# Altium schematic sheet Circuit Schematics.SchDoc
size A3; SheetNumber: 3; SheetTotal: 3
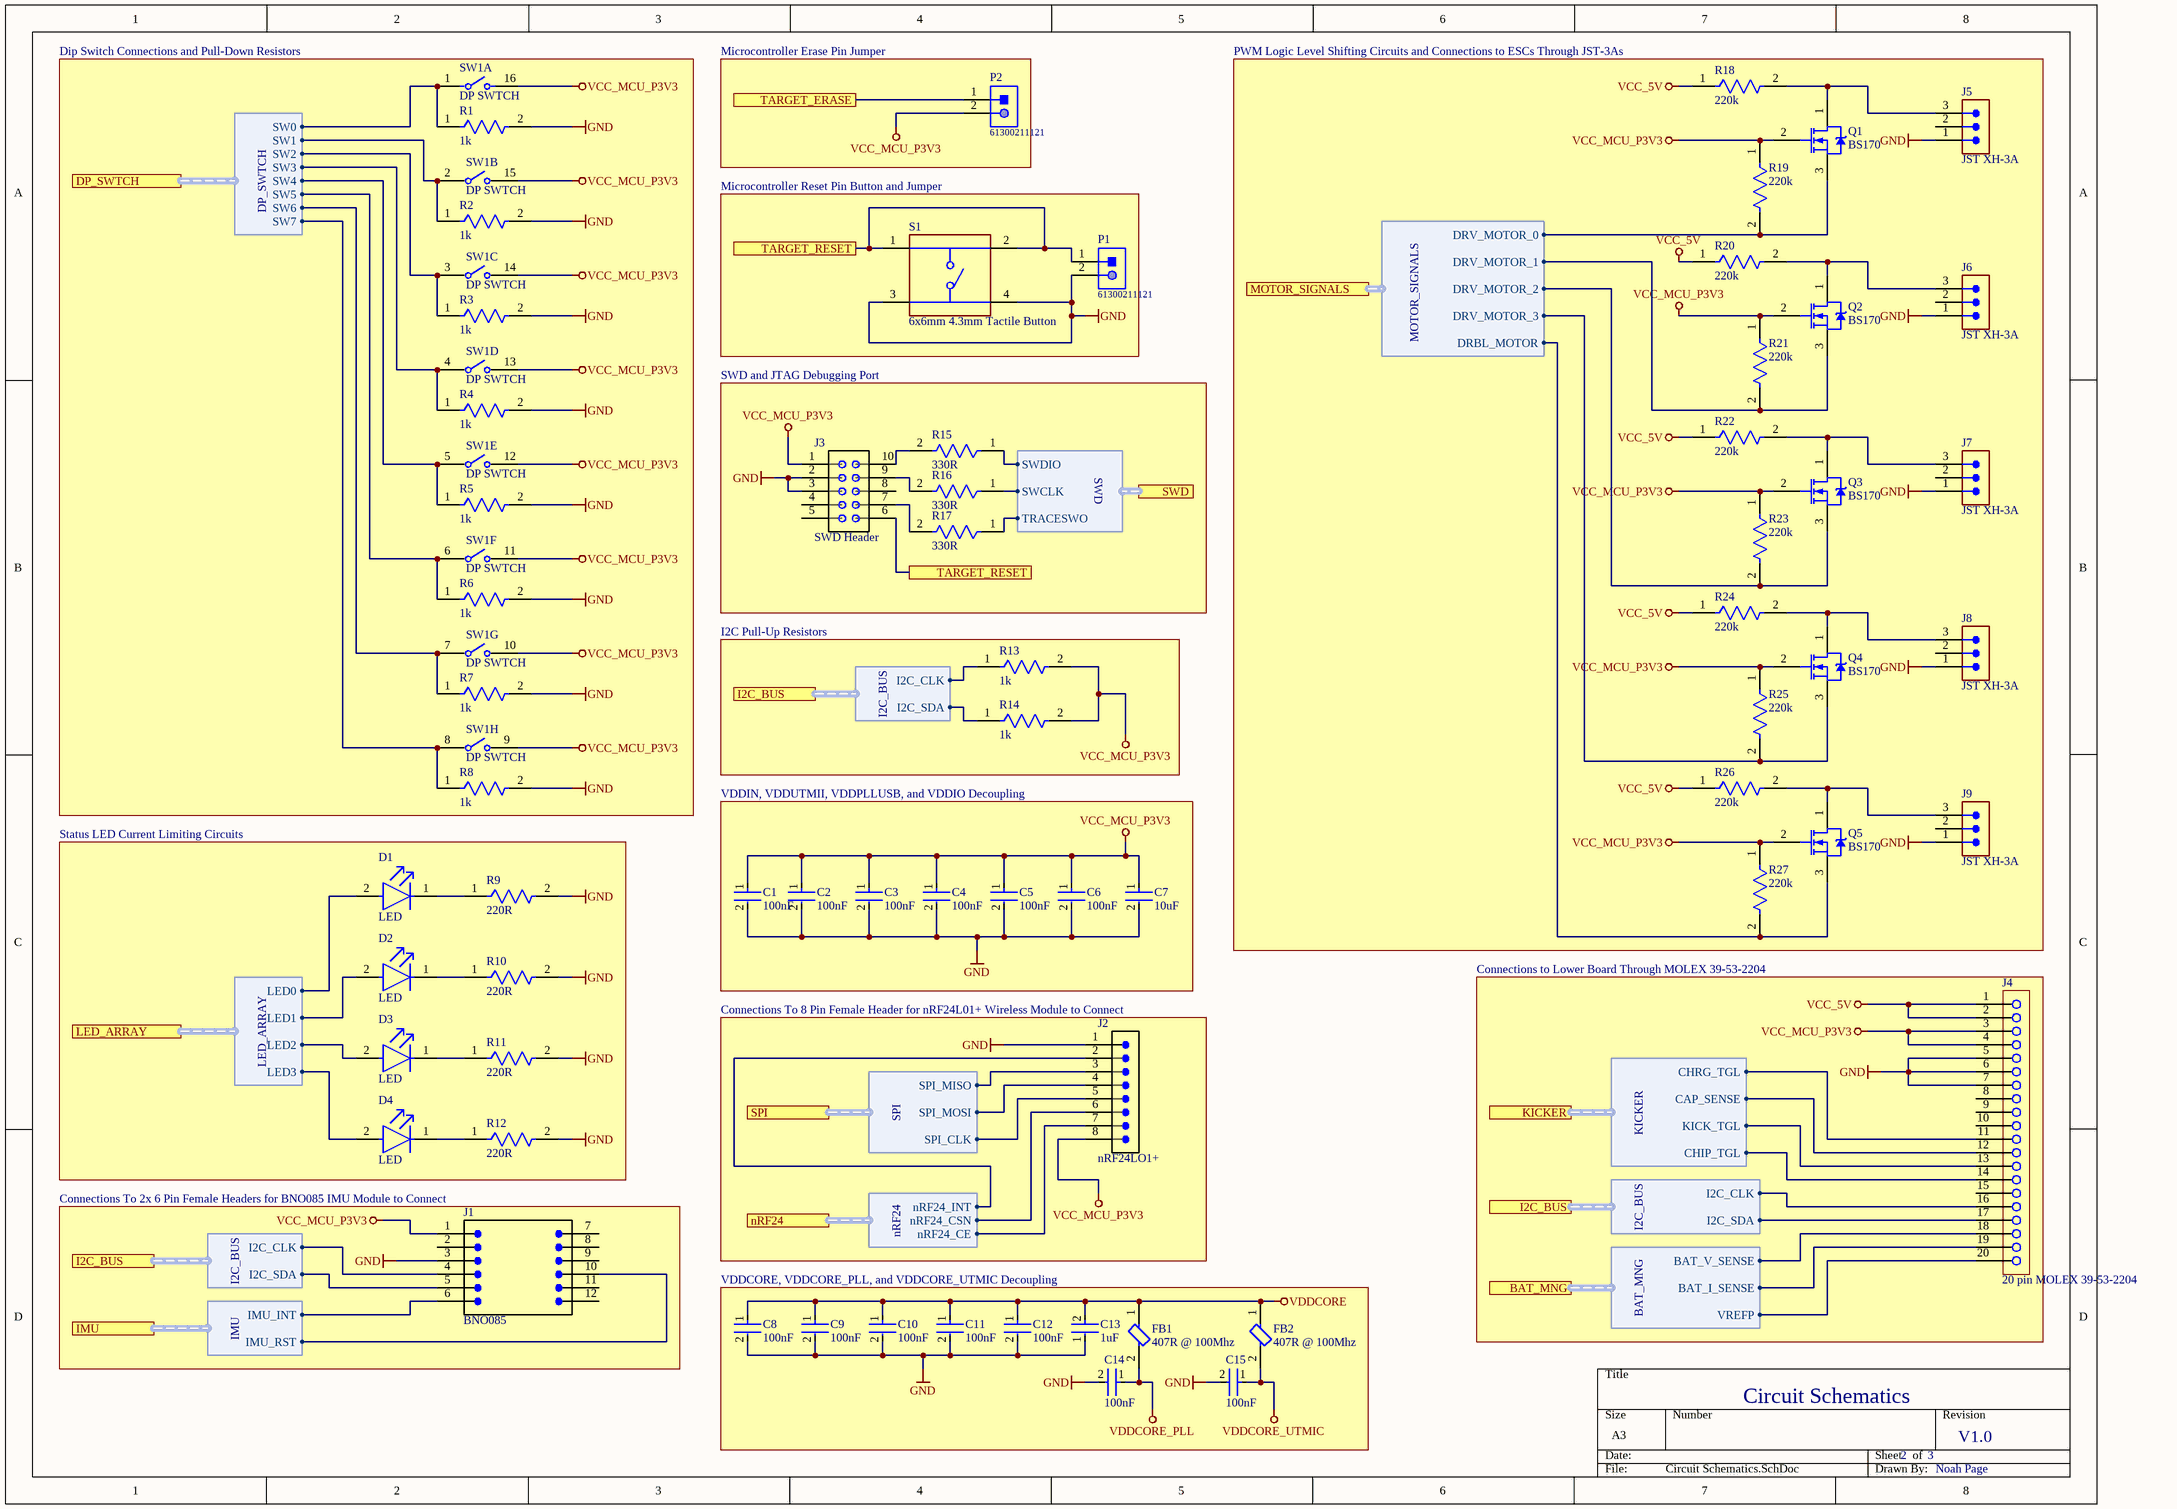
[diagram p0: Circuit Schematics.SchDoc]

## Parts
C1  100nF  [Capacitor 100nF 50V 20% 0603]
C2  100nF  [Capacitor 100nF 50V 20% 0603]
C3  100nF  [Capacitor 100nF 50V 20% 0603]
C4  100nF  [Capacitor 100nF 50V 20% 0603]
C5  100nF  [Capacitor 100nF 50V 20% 0603]
C6  100nF  [Capacitor 100nF 50V 20% 0603]
C7  10uF  [Capacitor 10uF 50V 20% 0805]
C8  100nF  [Capacitor 100nF 50V 20% 0603]
C9  100nF  [Capacitor 100nF 50V 20% 0603]
C10  100nF  [Capacitor 100nF 50V 20% 0603]
C11  100nF  [Capacitor 100nF 50V 20% 0603]
C12  100nF  [Capacitor 100nF 50V 20% 0603]
C13  1uF  [Capacitor 1uF 50V 10% 0603]
C14  100nF  [Capacitor 100nF 50V 20% 0603]
C15  100nF  [Capacitor 100nF 50V 20% 0603]
D1  LED  [LED RED 1206]
D2  LED  [LED RED 1206]
D3  LED  [LED RED 1206]
D4  LED  [LED RED 1206]
FB1  407R @ 100Mhz  [FERRITE BEAD 470R 100Mhz]
FB2  407R @ 100Mhz  [FERRITE BEAD 470R 100Mhz]
J1  BNO085  [(BNO085) FEMALE 2ct 8 unit separation 1x6 THT]
J2  nRF24LO1+  [(nRF24) FEMALE 1x8 2.54]
J3  SWD Header  [(SWD) FEMALE 10 pin 2 row 1.27mm]
J4  20 pin MOLEX 39-53-2204  [20Pin Molex 39-53-2204]
J5  JST XH-3A  [FP-B3B-XH-AM_LF_SN-MFG]
J6  JST XH-3A  [FP-B3B-XH-AM_LF_SN-MFG]
J7  JST XH-3A  [FP-B3B-XH-AM_LF_SN-MFG]
J8  JST XH-3A  [FP-B3B-XH-AM_LF_SN-MFG]
J9  JST XH-3A  [FP-B3B-XH-AM_LF_SN-MFG]
P1  61300211121  [2x 2.54mm MALE header pin]
P2  61300211121  [2x 2.54mm MALE header pin]
Q1  BS170  [MOSFET BS170]
Q2  BS170  [MOSFET BS170]
Q3  BS170  [MOSFET BS170]
Q4  BS170  [MOSFET BS170]
Q5  BS170  [MOSFET BS170]
R1  1k  [RESISTOR 1k 1% 1/4W 0603]
R2  1k  [RESISTOR 1k 1% 1/4W 0603]
R3  1k  [RESISTOR 1k 1% 1/4W 0603]
R4  1k  [RESISTOR 1k 1% 1/4W 0603]
R5  1k  [RESISTOR 1k 1% 1/4W 0603]
R6  1k  [RESISTOR 1k 1% 1/4W 0603]
R7  1k  [RESISTOR 1k 1% 1/4W 0603]
R8  1k  [RESISTOR 1k 1% 1/4W 0603]
R9  220R  [RESISTOR 220R 5% 1/4W 0603]
R10  220R  [RESISTOR 220R 5% 1/4W 0603]
R11  220R  [RESISTOR 220R 5% 1/4W 0603]
R12  220R  [RESISTOR 220R 5% 1/4W 0603]
R13  1k  [RESISTOR 1k 1% 1/4W 0603]
R14  1k  [RESISTOR 1k 1% 1/4W 0603]
R15  330R  [RESISTOR 330R 5% 1/4W 0603]
R16  330R  [RESISTOR 330R 5% 1/4W 0603]
R17  330R  [RESISTOR 330R 5% 1/4W 0603]
R18  220k  [RESISTOR 220k 5% 1/4W 0603]
R19  220k  [RESISTOR 220k 5% 1/4W 0603]
R20  220k  [RESISTOR 220k 5% 1/4W 0603]
R21  220k  [RESISTOR 220k 5% 1/4W 0603]
R22  220k  [RESISTOR 220k 5% 1/4W 0603]
R23  220k  [RESISTOR 220k 5% 1/4W 0603]
R24  220k  [RESISTOR 220k 5% 1/4W 0603]
R25  220k  [RESISTOR 220k 5% 1/4W 0603]
R26  220k  [RESISTOR 220k 5% 1/4W 0603]
R27  220k  [RESISTOR 220k 5% 1/4W 0603]
S1  6x6mm 4.3mm Tactile Button  [BUTTON 6x6x4.3 TACTILE SWITCH]
SW1  DP SWTCH  [8P DP SWTCH]  (parts A,B,C,D,E,F,G,H of 8)

## Blocks framed on the sheet
Dip Switch Connections and Pull-Down Resistors: R1-R8 SW1
Microcontroller Erase Pin Jumper: P2
Microcontroller Reset Pin Button and Jumper: P1 S1
SWD and JTAG Debugging Port: J3 R15-R17
I2C Pull-Up Resistors: R13 R14
VDDIN, VDDUTMII, VDDPLLUSB, and VDDIO Decoupling: C1-C7
Status LED Current Limiting Circuits: D1-D4 R9-R12
Connections to Lower Board Through MOLEX 39-53-2204: J4
VDDCORE, VDDCORE_PLL, and VDDCORE_UTMIC Decoupling: C8-C15 FB1 FB2

## Ports
BAT_MNG (harness BAT_MNG, see Microcontroller Schematic[3D]), DP_SWTCH (harness DP_SWTCH, see Microcontroller Schematic[1A]), I2C_BUS (harness I2C_BUS, see Circuit Schematics[1D], Circuit Schematics[3B], Microcontroller Schematic[1B]), I2C_BUS (harness I2C_BUS, see Circuit Schematics[1D], Circuit Schematics[6D], Microcontroller Schematic[1B]), I2C_BUS (harness I2C_BUS, see Circuit Schematics[3B], Circuit Schematics[6D], Microcontroller Schematic[1B]), IMU (harness IMU, see Microcontroller Schematic[1B]), KICKER (harness KICKER, see Microcontroller Schematic[3D]), LED_ARRAY (harness LED_ARRAY, see Microcontroller Schematic[1B]), MOTOR_SIGNALS (harness MOTOR_SIGNALS, see Microcontroller Schematic[4D]), nRF24 (harness nRF24, see Microcontroller Schematic[1C]), SPI (harness SPI, see Microcontroller Schematic[1C]), SWD (harness SWD, see Microcontroller Schematic[2D]), TARGET_ERASE (see Microcontroller Schematic[1C]), TARGET_RESET (see Circuit Schematics[3A], Microcontroller Schematic[1C]), TARGET_RESET (see Circuit Schematics[4B], Microcontroller Schematic[1C])

## Harnesses
DP_SWTCH: SW0, SW1, SW2, SW3, SW4, SW5, SW6, SW7
LED_ARRAY: LED0, LED1, LED2, LED3
I2C_BUS: I2C_CLK, I2C_SDA
IMU: IMU_INT, IMU_RST
SPI: SPI_MISO, SPI_MOSI, SPI_CLK
nRF24: nRF24_CSN, nRF24_CE, nRF24_INT
SWD: SWDIO, SWCLK, TRACESWO
BAT_MNG: BAT_V_SENSE, BAT_I_SENSE, VREFP
KICKER: CHRG_TGL, CAP_SENSE, KICK_TGL, CHIP_TGL
MOTOR_SIGNALS: DRV_MOTOR_0, DRV_MOTOR_1, DRV_MOTOR_2, DRV_MOTOR_3, DRBL_MOTOR

## Nets
GND: C1.2 C2.2 C3.2 C4.2 C5.2 C6.2 C7.2 C8.2 C9.2 C10.2 C11.2 C12.2 C13.1 C14.2 C15.2 J1.3 J2.1 J3.2 J3.3 J4.5 J4.6 J4.7 J5.1 J6.1 J7.1 J8.1 J9.1 P1.2 R1.2 R2.2 R3.2 R4.2 R5.2 R6.2 R7.2 R8.2 R9.2 R10.2 R11.2 R12.2 S1.3 S1.4
VCC_5V: J4.1 J4.2 R18.1 R20.1 R22.1 R24.1 R26.1
VCC_MCU_P3V3: C1.1 C2.1 C3.1 C4.1 C5.1 C6.1 C7.1 J1.1 J2.8 J3.1 J4.3 J4.4 P2.2 Q1.2(G) Q2.2(G) Q3.2(G) Q4.2(G) Q5.2(G) R13.2 R14.2 R19.1 R21.1 R23.1 R25.1 R27.1 SW1.9 SW1.10 SW1.11 SW1.12 SW1.13 SW1.14 SW1.15 SW1.16
VDDCORE: C8.1 C9.1 C10.1 C11.1 C12.1 C13.2 FB1.1 FB2.1
VDDCORE_PLL: C14.1 FB1.2
VDDCORE_UTMIC: C15.1 FB2.2
TARGET_ERASE: P2.1 ; port TARGET_ERASE
TARGET_RESET: J3.6 P1.1 S1.1 S1.2 ; port TARGET_RESET
NetD1_1: D1.1(C) R9.1
NetD1_2: D1.2(A) ; port LED_ARRAY.LED0
NetD2_1: D2.1(C) R10.1
NetD2_2: D2.2(A) ; port LED_ARRAY.LED1
NetD3_1: D3.1(C) R11.1
NetD3_2: D3.2(A) ; port LED_ARRAY.LED2
NetD4_1: D4.1(C) R12.1
NetD4_2: D4.2(A) ; port LED_ARRAY.LED3
NetJ1_4: J1.4 J4.16 R13.1 ; port I2C_BUS.I2C_CLK
NetJ1_5: J1.5 J4.17 R14.1 ; port I2C_BUS.I2C_SDA
NetJ1_6: J1.6 ; port IMU.IMU_INT
NetJ1_10: J1.10 ; port IMU.IMU_RST
NetJ2_2: J2.2 ; port nRF24.nRF24_INT
NetJ2_3: J2.3 ; port SPI.SPI_MISO
NetJ2_4: J2.4 ; port SPI.SPI_MOSI
NetJ2_5: J2.5 ; port SPI.SPI_CLK
NetJ2_6: J2.6 ; port nRF24.nRF24_CSN
NetJ2_7: J2.7 ; port nRF24.nRF24_CE
NetJ3_7: J3.7 R17.2
NetJ3_9: J3.9 R16.2
NetJ3_10: J3.10 R15.2
NetJ4_11: J4.11 ; port KICKER.CHRG_TGL
NetJ4_12: J4.12 ; port KICKER.CAP_SENSE
NetJ4_13: J4.13 ; port KICKER.KICK_TGL
NetJ4_14: J4.14 ; port KICKER.CHIP_TGL
NetJ4_18: J4.18 ; port BAT_MNG.BAT_V_SENSE
NetJ4_19: J4.19 ; port BAT_MNG.BAT_I_SENSE
NetJ4_20: J4.20 ; port BAT_MNG.VREFP
NetJ5_3: J5.3 Q1.1(D) R18.2
NetJ6_3: J6.3 Q2.1(D) R20.2
NetJ7_3: J7.3 Q3.1(D) R22.2
NetJ8_3: J8.3 Q4.1(D) R24.2
NetJ9_3: J9.3 Q5.1(D) R26.2
NetQ1_3: Q1.3(S) R19.2 ; port MOTOR_SIGNALS.DRV_MOTOR_0
NetQ2_3: Q2.3(S) R21.2 ; port MOTOR_SIGNALS.DRV_MOTOR_1
NetQ3_3: Q3.3(S) R23.2 ; port MOTOR_SIGNALS.DRV_MOTOR_2
NetQ4_3: Q4.3(S) R25.2 ; port MOTOR_SIGNALS.DRV_MOTOR_3
NetQ5_3: Q5.3(S) R27.2 ; port MOTOR_SIGNALS.DRBL_MOTOR
NetR1_1: R1.1 SW1.1 ; port DP_SWTCH.SW0
NetR2_1: R2.1 SW1.2 ; port DP_SWTCH.SW1
NetR3_1: R3.1 SW1.3 ; port DP_SWTCH.SW2
NetR4_1: R4.1 SW1.4 ; port DP_SWTCH.SW3
NetR5_1: R5.1 SW1.5 ; port DP_SWTCH.SW4
NetR6_1: R6.1 SW1.6 ; port DP_SWTCH.SW5
NetR7_1: R7.1 SW1.7 ; port DP_SWTCH.SW6
NetR8_1: R8.1 SW1.8 ; port DP_SWTCH.SW7
NetR15_1: R15.1 ; port SWD.SWDIO
NetR16_1: R16.1 ; port SWD.SWCLK
NetR17_1: R17.1 ; port SWD.TRACESWO

Not connected (* = marked no-connect by the designer): J1 2 7 8 9 11 12; J3 4 5 8; J4 8 9 10 15; J5 2; J6 2; J7 2; J8 2; J9 2

## Notes on the sheet
- (near R18) PWM Logic Level Shifting Circuits and Connections to ESCs Through JST-3As
- (near J2) Connections To 8 Pin Female Header for nRF24L01+ Wireless Module to Connect
- (near J1) Connections To 2x 6 Pin Female Headers for BNO085 IMU Module to Connect
- Circuit Schematics
- 2
- 3
- V1.0
- Noah Page

## Library data of the parts
C1-C6 C8-C12 C14 C15 = Capacitor 100nF 50V 20% 0603: Cap Ceramic 100nF 50V X7R ±20% Pad SMD 0603 +125°C T/R; Mount: Surface Mount; Lead Free: Lead Free; Max Operating Temperature: 125°C; Voltage Rating: 50V; Case Code (Imperial): 0603; Capacitance: 100nF; Height: 0.8mm; Length: 1.6mm; Tolerance: 20%; Case Code (Metric): 1608; Thickness: 0.035inch; Depth: 0.8mm; Width: 0.031inch; Package Quantity: 1; Min Operating Temperature: -55°C; Case/Package: 0603; Radiation Hardening: No; Voltage Rating (DC): 50V; Dielectric: X7R; Packaging: Tape and Reel; Digi-Key_Part_Number_1: 1276-1941-1-ND
C7 = Capacitor 10uF 50V 20% 0805: Chip Multilayer Ceramic Capacitors for General Purpose, 0805, 10uF, X5R, 15%, 20%, 50V; Digi-Key_Part_Number_1: 490-18664-1-ND
C13 = Capacitor 1uF 50V 10% 0603: Multilayer Ceramic Capacitors 1μF ±10% 50V X5R SMD 0603; Lead Free: Lead Free; Height: 0.8mm; Mount: Surface Mount; Radiation Hardening: No; Thickness: 0.035inch; Length: 1.6mm; Max Operating Temperature: 85°C; REACH SVHC: No SVHC; Min Operating Temperature: -55°C; Construction: Flat; RoHS Compliant: Yes; Voltage Rating: 50V; Dielectric: X5R; Packaging: Tape and Reel; Termination: SMD/SMT; Voltage Rating (DC): 50V; Case Code (Imperial): 0603; Voltage: 50V; Width: 0.031inch; Weight: 7.1E-05oz; Capacitance: 1uF; Depth: 0.8mm; Case Code (Metric): 1608; Series: C; Case/Package: 0603; Tolerance: 10%; Resistor Type: Ceramic; Number of Pins: 2; Dielectric Material: Ceramic; Package Quantity: 1; Digi-Key_Part_Number_1: 445-7468-1-ND
D1-D4 = LED RED 1206: LED RED DIFFUSED 1206 SMD; Manufacturer: VCC; Manufacturer Part Number: CMD15-21VRD/TR8; Led Orientation: Top View; Peak Emmision Wavelength: 640nm; Forward Current: 20mA; Power Dissipation: 105mW; Luminous Intensity: 4mcd; Forward Voltage: 2V; Reverse Voltage: 5V; Lead Free: Yes; Device Class L1: Optoelectronics; Package: CMD15-21; Temperature Range High: +85°C; Digikey Description: LED RED DIFFUSED 1206 SMD; Mouser Description: Standard LEDs - SMD RED DIFFUSED; Height: 1.3mm; ComponentLink2Description: Datasheet; ComponentLink2URL: https://www.vcclite.com/wp-content/uploads/wpallimport/files/files/CMD1521SeriesRev1.pdf; Temperature: -40°C to +85°C; Automotive: No; Octopart: https://octopart.com/cmd15-21vrd%2Ftr8-vcc-26668835; Temperature Range Low: -40°C; Device Class L3: unset; Colour: Red; Category: Diode; Device Class L2: LEDs; RoHS: TRUE; Digi-Key_Part_Number_1: L62301CT-ND
FB1 FB2 = Ferrite Bead 470R @ 100Mhz 25%: Chip Ferrite Bead, 0603, 470Ω @ 100MHz, 0.35Ω, 25%, 550mA; Resistance: 350mR; Number of Circuits: 1; Max DC Current: 500mA; Shielding: Unshielded; Impedance: 470R; Weight: 7.1E-05oz; Ratings: AEC-Q200; Contact Plating: Tin; Package Quantity: 4000; Case/Package: 0603; Number of Pins: 2; Core Material: Ferrite; Height: 0.037inch; Lead Free: Lead Free; Max Operating Temperature: 125°C; Width: 0.031inch; Termination: Flat; Case Code (Metric): 1608; Case Code (Imperial): 0603; Tolerance: 25%; Depth: 0.8mm; Min Operating Temperature: -55°C; Max Current Rating: 550mA; Packaging: Tape and Reel; Mount: Surface Mount; Length: 1.6mm; Radiation Hardening: No; Number of Lines: 1; Test Frequency: 100MHz; REACH SVHC: No SVHC; DC Resistance (DCR): 350mR; Digi-Key_Part_Number_1: 490-11025-1-ND
J1 = (BNO085) FEMALE 2ct 8 unit separation 1x6 THT: No Description Available; Mfr_Name: Sullins; Manufacturer_Part_Number: PPTC061LFBN-RC; Copyright: Copyright (C) 2022 Ultra Librarian. All rights reserved.; Digi-Key_Part_Number_1: S7004-ND; RefDes: RefDes; Type: DEV
J2 = (nRF24) FEMALE 1x8 2.54: No Description Available; Mfr_Name: Sullins; Manufacturer_Part_Number: PPTC081LFBN-RC; Copyright: Copyright (C) 2022 Ultra Librarian. All rights reserved.; Digi-Key_Part_Number_1: S7006-ND; RefDes: RefDes; Type: DEV
J3 = (SWD) FEMALE 10 pin 2 row 1.27mm: No Description Available; Mfr_Name: CNC Tech; Manufacturer_Part_Number: 3220-10-0100-00; Copyright: Copyright (C) 2022 Ultra Librarian. All rights reserved.; Digi-Key_Part_Number_1: 1175-1627-ND; RefDes: RefDes; Type: DEV
J4 = 20 pin MOLEX 39-53-2204: 1.25 mm Pitch FPC Connector, 5.0 mm Mated Height, Right Angle, ZIF, Through Hole, Top Contact, 20 Circuits, -20 to 80 degC, ELV and RoHS Compliant, Tray; PCB Locator: No; Voltage (Max): 200V; Pitch - Mating Interface: 1.25mm; Entry Angle: 90degrees Angle; PCB Retention: None; Circuits (Loaded): 20; Material - Plating Termination: Tin-Bismuth; Material - Metal: Phosphor Bronze; Current (Max per Contact): 1A; Mated Height: 5.00mm; Durability (mating cycles max): 30; ComponentLink1Description: Manufacturer URL; ComponentLink2Description: Datasheet; ComponentLink1URL: http://www.molex.com/molex/index.jsp; ComponentLink3Description: Package Specification; Polarized to PCB: No; Packing: Tray; Contact Position: Top; ComponentLink2URL: http://www.molex.com/webdocs/datasheets/pdf/en-us/0039532204_FFC_FPC_CONNECTORS.pdf; Number of Rows: 1; ComponentLink3URL: http://www.molex.com/pdm_docs/sd/039532204_sd.pdf; PackageDescription: 20-Lead FPC Connector, Pitch 1.25 mm; Mounting Technology: Through Hole; Stackable: No; RoHS: TRUE; PartNumber: 39-53-2204; Orientation: Right Angle; PackageVersion: Rev. B, 04/2007; PackageReference: 39-53-2204; Manufacturer: Molex; Material - Plating Mating: Tin-Bismuth; Digi-Key_Part_Number_1: WM4444-ND
J5-J9 = 3pin JSTHX MALE: CONN HEADER VERT 3POS 2.5MM; Max Current Rating: 3A; Gender: Male; Max Voltage Rating (AC): 250V; Connector Type: Male Pin; Pitch: 0.098inch; Number of Positions: 3; Contact Resistance: 20mR; Termination: Press-Fit; Housing Color: White; Housing Material: Polyamide; Orientation: Straight; Contact Material: Brass; Contact Type: Male Pin; Color: Natural; Packaging: Bulk; Lead Free: Lead Free; Depth: 5.75mm; Number of Rows: 1; Contact Plating: Tin; Length: 9.9mm; Max Operating Temperature: 85°C; Series: XH; Min Operating Temperature: -25°C; Fastening Type: Detent; Mount: Through Hole; Digi-Key_Part_Number_1: 455-2231-ND
P1 P2 = 2x 2.54mm Male Header: THT Vertical Pin Header WR-PHD, Pitch 2.54 mm, Single Row, 2 pins; Manufacturer: Wurth Elektronik; Rated Current: 3A; Gender: Male; Withstanding Voltage: 500VAC; Working Voltage: 250VAC; Pitch: 2.54mm; Contact Resistance: 20mOhm; Pin Number: 2; Mounting Technology: THT; Orientation: Vertical; Operating Temperature: -40to105degC; Packaging: Bag; Publisher: WurthElektronik; Datasheet URL: https://katalog.we-online.de/em/datasheet/6130xx11121.pdf; Manufacturer URL: http://www.we-online.de; Row Number: Single; Package Reference: 61300211121; Part Number: 61300211121; Digi-Key_Part_Number_1: 732-5315-ND
Q1-Q5 = MOSFET Transistor NChannel Logic Level BS170: Small Signal MOSFET, 500 mA, 60 V, N-Channel, 3-Pin TO-92, Bulk Box; Manufacturer: On Semiconductor; VGS Max (V): 20; Configuration: Single; PD Max (W): 0.35; VGS(th) Max (V): 3; ID Max (A): 0.5; V(BR)DSS Min (V): 60; PackageDescription: 3-Pin Transistor Outline, Body 4.825 x 3.685 mm, Pitch 1.27 mm; Package Type: TO-92; ComponentLink1Description: Manufacturer URL; ComponentLink1URL: http://www.onsemi.com/; DatasheetVersion: Rev. 6; ComponentLink3Description: Package Specification; PartNumber: BS170; ComponentLink2URL: http://www.onsemi.com/pub_link/Collateral/BS170-D.PDF; PackageVersion: Rev. AM; Mounting Technology: Through Hole; PackageReference: TO-92-3-29-11_AM_SL; ComponentLink2Description: Datasheet; ComponentLink3URL: http://www.onsemi.cn/pub_link/Collateral/2N6426-D.PDF; Channel Polarity: N Channel; Packing: Bulk Box; Digi-Key_Part_Number_1: 2368-BS170-ND
R1-R8 R13 R14 = Resistor 1k 1% 0.25W 0603: 1kΩ ±1% 0.25W 0603 Anti-Surge Chip Resistor AEC-Q200; Power Rating: 250mW; Resistance: 1kR; Temperature Coefficient: 100ppm/°C; Series: ESR; Max Operating Temperature: 155°C; Case Code (Metric): 1608; Package Quantity: 1; Case/Package: 0603; Size Code: 0603; Case Code (Imperial): 0603; Min Operating Temperature: -55°C; Tolerance: 1%; Max Power Dissipation: 250mW; Number of Terminations: 2; RoHS Compliant: Yes; Lead Free: Lead Free; Packaging: Tape and Reel; Height: 0.022inch; Width: 0.031inch; Features: Automotive AEC-Q200; Resistor Type: Thick Film; Length: 0.063inch; Digi-Key_Part_Number_1: RHM1.00KADCT-ND
R9-R12 = Resistor 220R 5% 0.25W 0603: 220Ω ±5% 0.25W 0603 Anti-Surge Chip Resistor AEC-Q200; Max Power Dissipation: 250mW; Temperature Coefficient: 200ppm/°C; Max Operating Temperature: 155°C; Resistor Type: Thick Film; Case/Package: 0603; Features: Automotive AEC-Q200; Case Code (Imperial): 0603; Series: ESR; Number of Terminations: 2; RoHS Compliant: Yes; Case Code (Metric): 1608; Resistance: 220R; Tolerance: 5%; Lead Free: Lead Free; Length: 0.063inch; Height: 0.022inch; Packaging: Tape and Reel; Width: 0.031inch; Package Quantity: 1; Min Operating Temperature: -55°C; Digi-Key_Part_Number_1: RHM220DCT-ND
R15-R17 = Resistor 330R 5% 0.25W 0603: 330Ω ±5% 0.25W 0603 Anti-Surge Chip Resistor AEC-Q200; Temperature Coefficient: 200ppm/°C; Max Power Dissipation: 250mW; Case/Package: 0603; Case Code (Metric): 1608; RoHS Compliant: Yes; Max Operating Temperature: 155°C; Packaging: Tape and Reel; Resistance: 330R; Features: Automotive AEC-Q200; Width: 0.8mm; Case Code (Imperial): 0603; Length: 1.6mm; Height: 0.45mm; Min Operating Temperature: -55°C; Series: ESR; Tolerance: 5%; Number of Terminations: 2; Digi-Key_Part_Number_1: RHM330DCT-ND
R18-R27 = Resistor 220k 5% 0.25W 0603: 220kΩ ±5% 0.25W 0603 Anti-Surge Chip Resistor AEC-Q200; Resistance: 220kR; Max Power Dissipation: 250mW; Temperature Coefficient: 200ppm/°C; Case/Package: 0603; Min Operating Temperature: -55°C; Case Code (Imperial): 0603; Width: 0.031inch; Length: 0.063inch; Packaging: Tape and Reel; Height: 0.022inch; Tolerance: 5%; Features: Automotive AEC-Q200; Max Operating Temperature: 155°C; Case Code (Metric): 1608; Number of Terminations: 2; RoHS Compliant: Yes; Resistor Type: Thick Film; Package Quantity: 5000; Series: ESR; Digi-Key_Part_Number_1: RHM220KDCT-ND
S1 = 6x6mm 4.3mm Tactile Button: 6 x 6 mm, 4.3 mm Actuator Height, 160 gf, Black, Long Crimped, Through Hole, SPST, Tactile Switch; MF: CUI Devices; MP: TS02-66-43-BK-160-LCR-D; SnapEDA_Link: https://www.snapeda.com/parts/TS02-66-43-BK-160-LCR-D/CUI+Devices/view-part/?ref=snap; Check_prices: https://www.snapeda.com/parts/TS02-66-43-BK-160-LCR-D/CUI+Devices/view-part/?ref=eda; Availability: In Stock; Value: *; Package: None; Purchase-URL: https://pricing.snapeda.com/search/part/TS02-66-43-BK-160-LCR-D/?ref=eda; Price: None; CUI_purchase_URL: https://www.cuidevices.com/product/switches/tactile-switches/ts02-series?utm_source=snapeda.com&utm_medium=referral&utm_campaign=snapedaBOM; Digi-Key_Part_Number_1: 2223-TS02-66-43-BK-160-LCR-D-ND
SW1 = 8Pin 20V 100mA Dip Switch: SWITCH SLIDE DIP SPST 100MA 20V; Washable: Yes; Pitch: 0.1inch; Electrical Life: 2000Cycles; Number of Positions: 8; Actuator Type: Slide (Standard); Lead Free: Lead Free; Radiation Hardening: No; Packaging: Tape and Reel; Contact Plating: Gold; Throw Configuration: SPST; Depth: 9.91mm; Min Operating Temperature: -55°C; Termination: Gull Wing; Max Voltage Rating (DC): 20V; Mount: Surface Mount; Package Quantity: 1000; Voltage Rating (DC): 20V; Mechanical Life: 2000Cycles; Orientation: Straight; Max Operating Temperature: 85°C; Max Current Rating: 100mA; Current Rating: 100mA; Contact Material: Copper; Length: 0.858inch; Digi-Key_Part_Number_1: CT3121CT-ND